# EAGLE design 6thapril eagle (EAGLE 7.5.0)
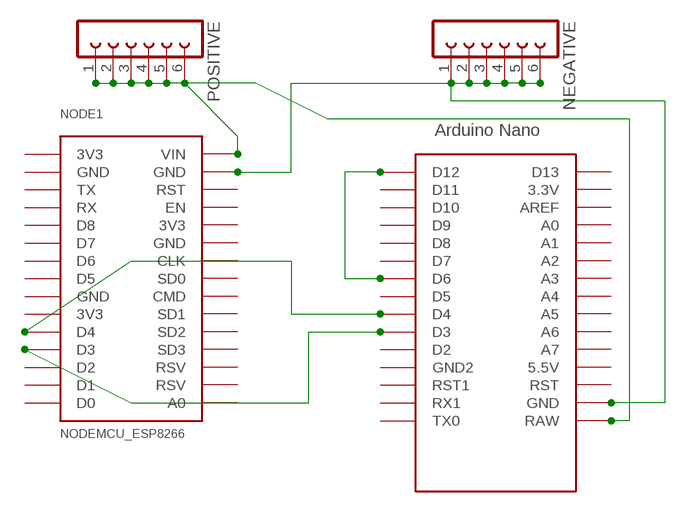
[diagram p0: schematic, sheet 1]

## Parts
NEGATIVE  FE06-1  [FE06]
NODE1  NODEMCU_ESP8266  [NODEMCU_ESP8266]
POSITIVE  FE06-1  [FE06]
U$1  NANO  [NANO]

## Nets
N$1: NODE1.D3 U$1.D3
N$2: NODE1.D4 U$1.D4
N$3: NODE1.VIN POSITIVE.1 POSITIVE.2 POSITIVE.3 POSITIVE.4 POSITIVE.5 POSITIVE.6 U$1.RAW
N$4: NEGATIVE.1 NEGATIVE.2 NEGATIVE.3 NEGATIVE.4 NEGATIVE.5 NEGATIVE.6 NODE1.GND@4(GND) U$1.GND
N$7: U$1.D6 U$1.D12
Unconnected: NODE1.A0 NODE1.CLK NODE1.CMD NODE1.D0 NODE1.D1 NODE1.D2 NODE1.D5 NODE1.D6 NODE1.D7 NODE1.D8 NODE1.EN NODE1.RST NODE1.RSV1(RSV) NODE1.RSV2(RSV) NODE1.RX NODE1.SD1 NODE1.SD2 NODE1.SD3 NODE1.SDO(SD0) NODE1.TX U$1.3.3V U$1.5V(5.5V) U$1.A0 U$1.A1 U$1.A2 U$1.A3 U$1.A4 U$1.A5 U$1.A6 U$1.A7 U$1.AREF U$1.D2 U$1.D5 U$1.D7 U$1.D8 U$1.D9 U$1.D10 U$1.D11 U$1.D13 U$1.GND1(GND2) U$1.ICSP1 U$1.ICSP2 U$1.ICSP3 U$1.ICSP4 U$1.ICSP5 U$1.ICSP6 U$1.RST U$1.RST1 U$1.RX1 U$1.TX0

## Power pins joined to a net without a drawn wire
3V3: NODE1.3V3@1(3V3) NODE1.3V3@2(3V3) NODE1.3V3@3(3V3)
GND: NODE1.GND@1(GND) NODE1.GND@2(GND) NODE1.GND@3(GND)

## Library data of the parts
NEGATIVE POSITIVE = con-lsta:FE06-1: FEMALE HEADER; OC_FARNELL: unknown; OC_NEWARK: unknown
NODE1 = nodemcu_esp8266:NODEMCU_ESP8266: Node MCU V2 (ESP8266) Created by Harish
U$1 = Arduino-clone:NANO: Arduino Nano

## Net classes
0 default: width 1.016 mm, clearance 1.016 mm

## Board
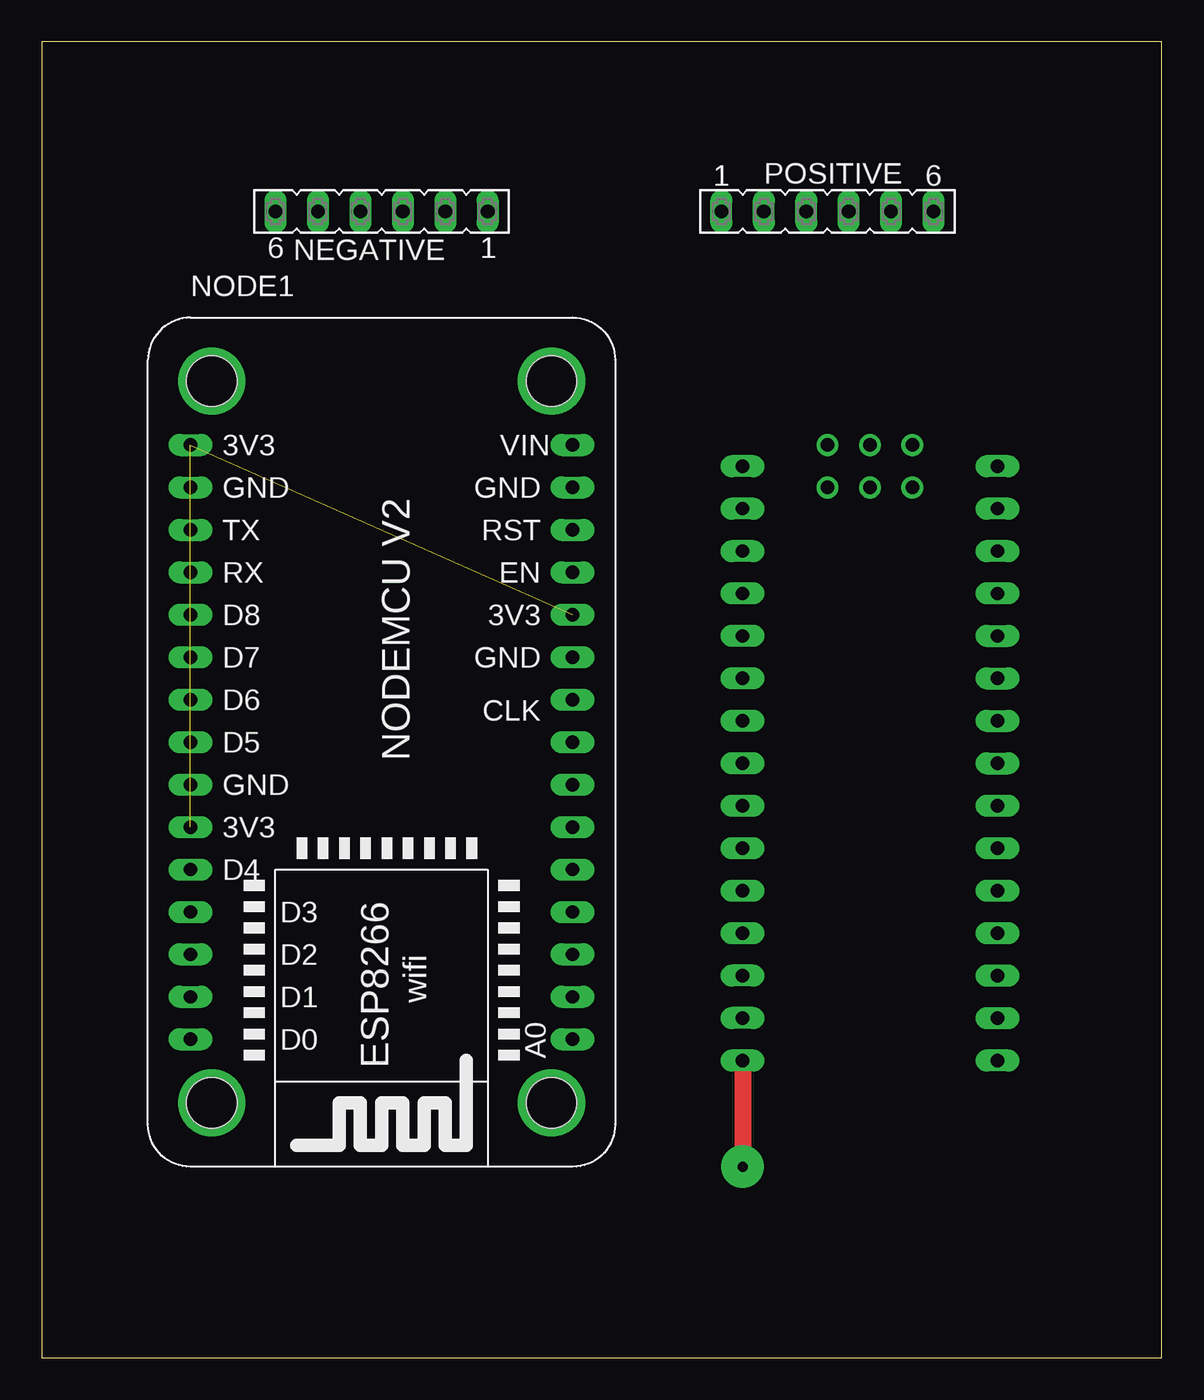
[diagram p1: board, top side]
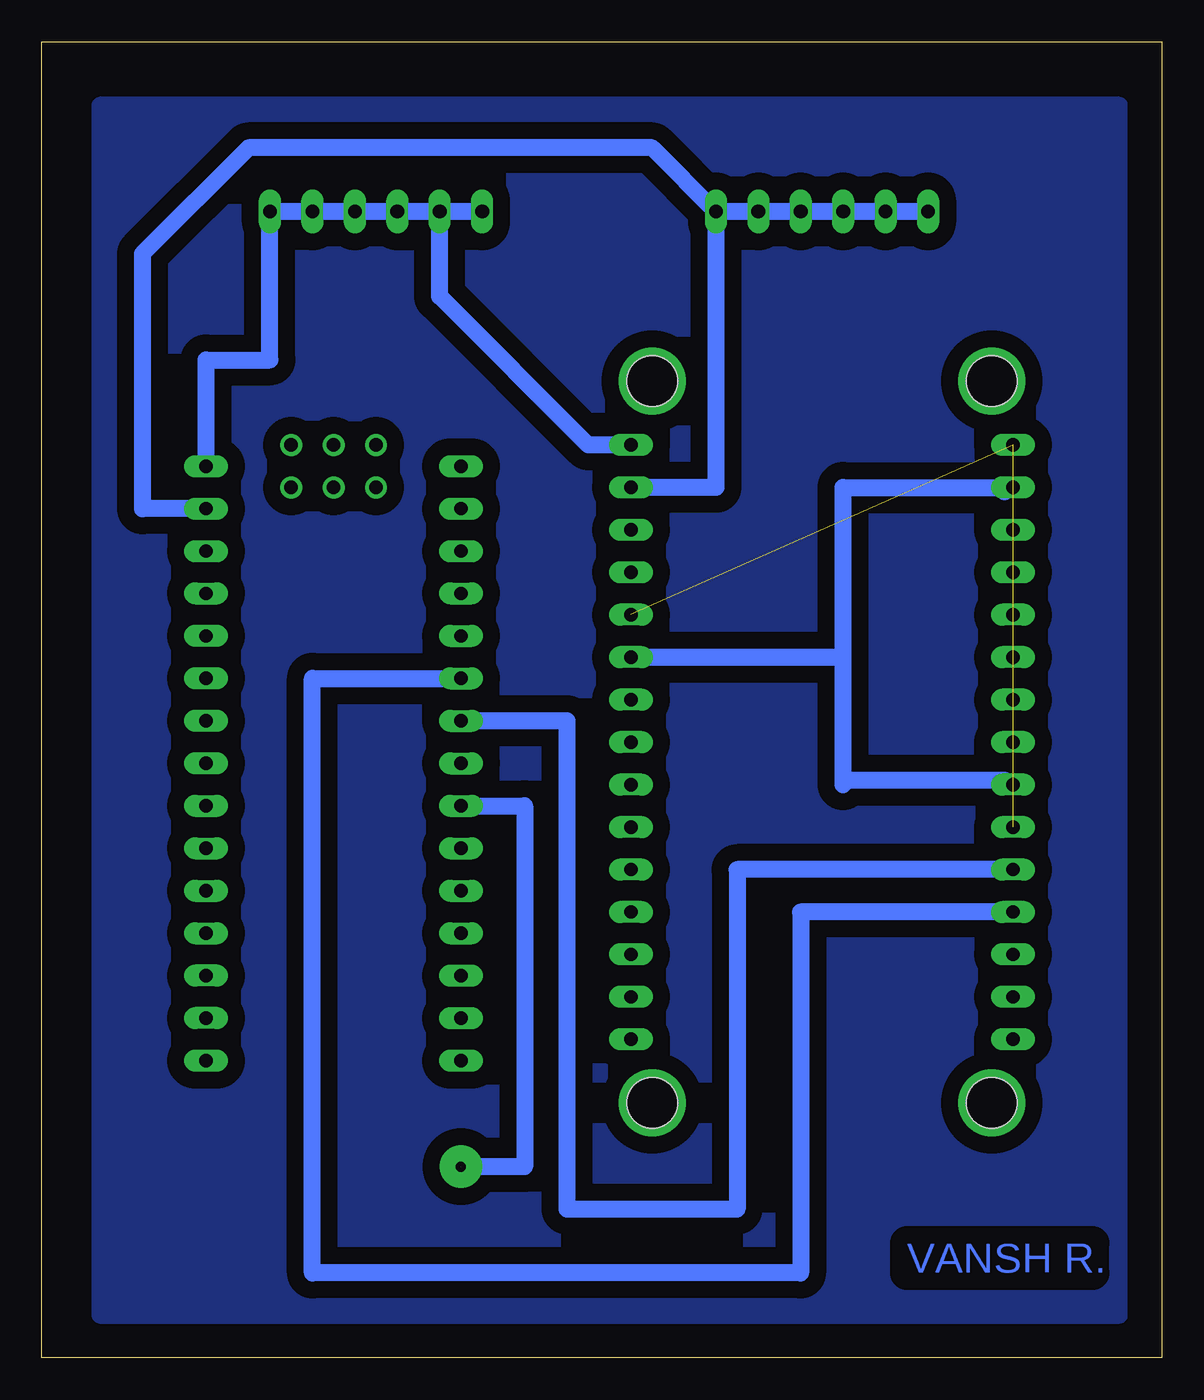
[diagram p2: board, bottom side, seen from below]

Size 66.98 x 78.73 mm. Coordinates in mm from the lower left corner, seen from the top.
Outline: 0,0 66.98,0 66.98,78.73 0,78.73 0,0
Copper layers (1*16): Top 0.035mm / dielectric 1.5mm / Bottom 0.035mm
Design rules "default *": minimum track width 10mil, minimum drill 24mil, track to track 40mil, track to pad 40mil, pad to pad 40mil, via to via 40mil, smd to smd 8mil, copper to edge 40mil, drill to drill 8mil, minimum pad ring 10mil, minimum via ring 8mil, stop-mask expansion 4mil, vias tented up to drill 0mil, thermal gap 10mil

### Footprints (pad centres in the part's own frame; a part is rotated, then mirrored left to right if it is on the bottom)
FE06 = drill 0.813 long: 1 -6.35,0; 2 -3.81,0; 3 -1.27,0; 4 1.27,0; 5 3.81,0; 6 6.35,0
NODEMCU_ESP8266 = drill 0.8 long: 3V3@1 -11.43,19.05; 3V3@2 -11.43,-3.81; 3V3@3 11.43,8.89; A0 11.43,-16.51; CLK 11.43,3.81; CMD 11.43,-1.27; D0 -11.43,-16.51; D1 -11.43,-13.97; D2 -11.43,-11.43; D3 -11.43,-8.89; D4 -11.43,-6.35; D5 -11.43,1.27; D6 -11.43,3.81; D7 -11.43,6.35; D8 -11.43,8.89; EN 11.43,11.43; GND@1 -11.43,16.51; GND@2 -11.43,-1.27; GND@3 11.43,6.35; GND@4 11.43,16.51; RST 11.43,13.97; RSV1 11.43,-11.43; RSV2 11.43,-13.97; RX -11.43,11.43; SD1 11.43,-3.81; SD2 11.43,-6.35; SD3 11.43,-8.89; SDO 11.43,1.27; TX -11.43,13.97; VIN 11.43,19.05 | drill 3: P$31 10.16,22.86; P$32 -10.16,22.86; P$33 -10.16,-20.32; P$34 10.16,-20.32 | hole 3: 10.16,22.86; 10.16,-20.32; -10.16,-20.32; -10.16,22.86
NANO = drill 0.8 long: 3.3V -10.16,24.13; 5V -10.16,-1.27; A0 -10.16,19.05; A1 -10.16,16.51; A2 -10.16,13.97; A3 -10.16,11.43; A4 -10.16,8.89; A5 -10.16,6.35; A6 -10.16,3.81; A7 -10.16,1.27; AREF -10.16,21.59; D2 5.08,1.27; D3 5.08,3.81; D4 5.08,6.35; D5 5.08,8.89; D6 5.08,11.43; D7 5.08,13.97; D8 5.08,16.51; D9 5.08,19.05; D10 5.08,21.59; D11 5.08,24.13; D12 5.08,26.67; D13 -10.16,26.67; GND -10.16,-6.35; GND1 5.08,-1.27; RAW -10.16,-8.89; RST -10.16,-3.81; RST1 5.08,-3.81; RX1 5.08,-6.35; TX0 5.08,-8.89 | drill 0.8: ICSP1 -5.08,-10.16; ICSP2 -5.08,-7.62; ICSP3 -2.54,-10.16; ICSP4 -2.54,-7.62; ICSP5 0,-10.16; ICSP6 0,-7.62

### Placement (x,y rotation side)
NEGATIVE  20.32,68.58 180 top
NODE1  20.32,35.56 0 top
POSITIVE  46.99,68.58 0 top
U$1  46.99,44.45 180 top

### Tracks (layer width: path | path; a pad name or v marks a point on that pad's centre or on a via)
3V3  (2 unrouted)
GND
  Bottom 1.016: NODE1.GND@2 9.4,34.54 18.8,34.54 19.05,34.29 19.05,41.91 | 9.4,51.82 NODE1.GND@1 19.05,52.07 19.05,41.91 | NODE1.GND@3 19.05,41.91
N$1
  Bottom 1.016: NODE1.D3 21.59,26.67 21.59,5.08 50.8,5.08 50.8,40.64 U$1.D3
N$2
  Bottom 1.016: NODE1.D4 25.4,29.21 25.4,8.89 35.56,8.89 35.56,38.1 U$1.D4
N$3
  Bottom 1.016: POSITIVE.1 POSITIVE.2 | POSITIVE.2 POSITIVE.3 POSITIVE.4 POSITIVE.5 POSITIVE.6 53.34,59.69 57.15,59.69 U$1.RAW | NODE1.VIN 34.29,54.61 43.18,63.5 POSITIVE.2
N$4
  Bottom 1.016: NEGATIVE.1 26.67,52.07 NODE1.GND@4 | NEGATIVE.6 NEGATIVE.5 NEGATIVE.4 NEGATIVE.3 NEGATIVE.2 NEGATIVE.1 | U$1.GND 60.96,50.8 60.96,66.04 54.61,72.39 30.48,72.39 NEGATIVE.1
N$5
  pour Bottom: 2.54,2.54 2.54,74.93 63.5,74.93 63.5,2.54
N$6  (via drill 0.6 pad 2.54)
  other vias: 41.91,11.43
N$7  (1 unrouted)
  Top 1.016: U$1.D12 41.91,11.43
  Bottom 1.016: U$1.D6 38.1,33.02 38.1,11.43 41.91,11.43

### Text on the board
Bottom: VANSH R.